# Altium schematic sheet TS Precharge and TSAL.SchDoc
size Tabloid; SheetNumber: 3; SheetTotal: 5
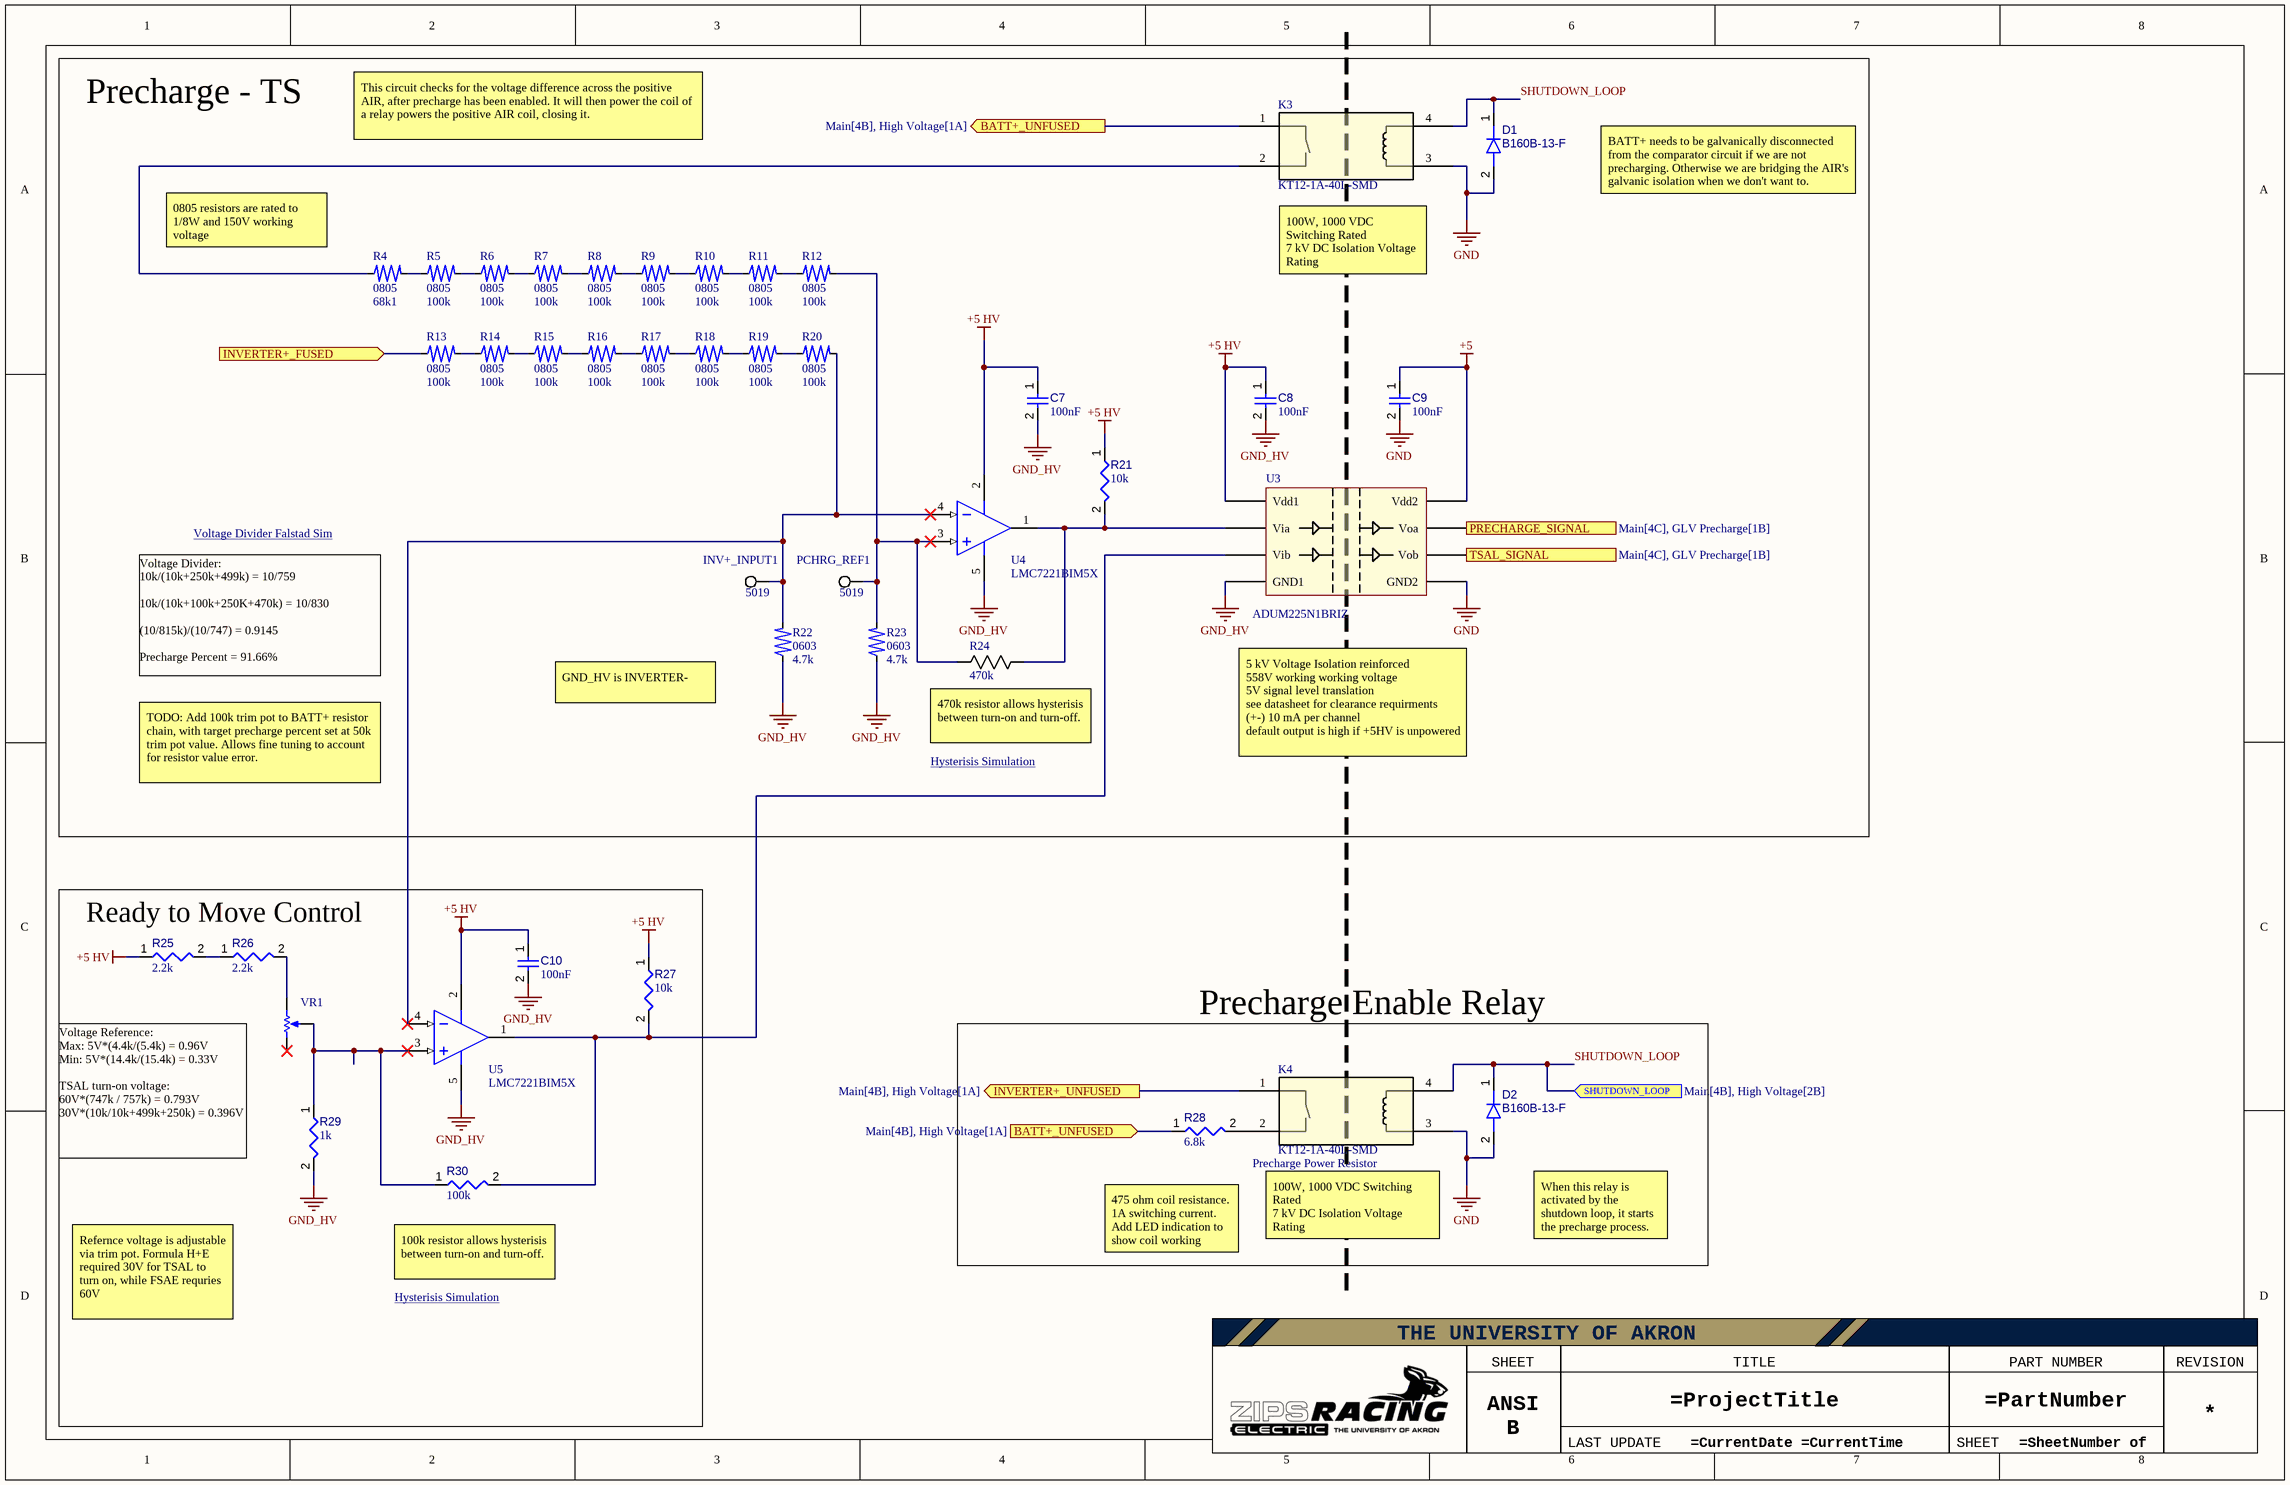
[diagram p0: TS Precharge and TSAL.SchDoc]

## Parts
C7  value 100nF  [CAPC1608X90X40NL10T20]  (hidden comment: Capacitor 100 nF +/-10% 50 V 0603)
C8  value 100nF  [CAPC1608X90X40NL10T20]  (hidden comment: Capacitor 100 nF +/-10% 50 V 0603)
C9  value 100nF  [CAPC1608X90X40NL10T20]  (hidden comment: Capacitor 100 nF +/-10% 50 V 0603)
C10  value 100nF  [CAPC1608X90X40NL10T20]  (hidden comment: Capacitor 100 nF +/-10% 50 V 0603)
D1  B160B-13-F  [FP-SMB-MFG]
D2  B160B-13-F  [FP-SMB-MFG]
INV+_INPUT1  5019  [KSTN-5019_V]
K3  KT12-1A-40L-SMD  [New footprint 1]
K4  KT12-1A-40L-SMD  [New footprint 1]
PCHRG_REF1  5019  [KSTN-5019_V]
R4  value 68k1  Footprint: 0805  [RES-0805-GENERIC]  (hidden comment: Resistor 68k1 0805 1%)
R5  value 100k  Footprint: 0805  [RES-0805-GENERIC]  (hidden comment: Resistor 100k 0805 1%)
R6  value 100k  Footprint: 0805  [RES-0805-GENERIC]  (hidden comment: Resistor 100k 0805 1%)
R7  value 100k  Footprint: 0805  [RES-0805-GENERIC]  (hidden comment: Resistor 100k 0805 1%)
R8  value 100k  Footprint: 0805  [RES-0805-GENERIC]  (hidden comment: Resistor 100k 0805 1%)
R9  value 100k  Footprint: 0805  [RES-0805-GENERIC]  (hidden comment: Resistor 100k 0805 1%)
R10  value 100k  Footprint: 0805  [RES-0805-GENERIC]  (hidden comment: Resistor 100k 0805 1%)
R11  value 100k  Footprint: 0805  [RES-0805-GENERIC]  (hidden comment: Resistor 100k 0805 1%)
R12  value 100k  Footprint: 0805  [RES-0805-GENERIC]  (hidden comment: Resistor 100k 0805 1%)
R13  value 100k  Footprint: 0805  [RES-0805-GENERIC]  (hidden comment: Resistor 100k 0805 1%)
R14  value 100k  Footprint: 0805  [RES-0805-GENERIC]  (hidden comment: Resistor 100k 0805 1%)
R15  value 100k  Footprint: 0805  [RES-0805-GENERIC]  (hidden comment: Resistor 100k 0805 1%)
R16  value 100k  Footprint: 0805  [RES-0805-GENERIC]  (hidden comment: Resistor 100k 0805 1%)
R17  value 100k  Footprint: 0805  [RES-0805-GENERIC]  (hidden comment: Resistor 100k 0805 1%)
R18  value 100k  Footprint: 0805  [RES-0805-GENERIC]  (hidden comment: Resistor 100k 0805 1%)
R19  value 100k  Footprint: 0805  [RES-0805-GENERIC]  (hidden comment: Resistor 100k 0805 1%)
R20  value 100k  Footprint: 0805  [RES-0805-GENERIC]  (hidden comment: Resistor 100k 0805 1%)
R21  value 10k  [RESC1608X55X25ML10T15]  (hidden comment: Resistor 10k +/-1% 0603 100 mW)
R22  value 4.7k  Footprint: 0603  [RES-0603-Generic]  (hidden comment: Resistor 4k7 0603 1%)
R23  value 4.7k  Footprint: 0603  [RES-0603-Generic]  (hidden comment: Resistor 4k7 0603 1%)
R24  value 470k  [R0603]  (hidden comment: RES_0603_470k)
R25  value 2.2k  [RESC1608X55X25LL10T15]  (hidden comment: Resistor 2.2k +/-1% 0603 100mW)
R26  value 2.2k  [RESC1608X55X25LL10T15]  (hidden comment: Resistor 2.2k +/-1% 0603 100mW)
R27  value 10k  [RESC1608X55X25ML10T15]  (hidden comment: Resistor 10k +/-1% 0603 100 mW)
R28  value 6.8k  [New footprint 1]  (hidden comment: HSA506K8J)
R29  value 1k  [RESC1608X55X25ML10T15]  (hidden comment: Resistor 1k +/-1% 0603 100 mW)
R30  value 100k  [RESC1608X55X25ML10T15]  (hidden comment: Resistor 100k +/-1% 0603 100 mW)
U3  ADUM225N1BRIZ  [SOIC127P1030X265-8N]
U4  LMC7221BIM5X  [DBV0005A_L]
U5  LMC7221BIM5X  [DBV0005A_L]
VR1  3362P-1-103LF  [BOUR-3362P]  (value not drawn)

## Blocks framed on the sheet
Precharge - TS: C7-C9 D1 INV+_INPUT1 K3 PCHRG_REF1 R4-R24 U3 U4
Ready to Move Control: C10 R25-R27 R29 R30 U5 VR1
Precharge Enable Relay: D2 K4 R28

## Ports
BATT+_UNFUSED (in, see Main[4B], High Voltage[1A]), BATT+_UNFUSED (out, see Main[4B], High Voltage[1A]), INVERTER+_FUSED (in, see Main[4B], High Voltage[1A], Indicator Light[2A]), INVERTER+_UNFUSED (out, see Main[4B], High Voltage[1A]), PRECHARGE_SIGNAL (out, see Main[4C], GLV Precharge[1B]), SHUTDOWN_LOOP (in, see Main[4B], High Voltage[2B]), TSAL_SIGNAL (out, see Main[4C], GLV Precharge[1B])

## Nets
+5: C9.1 U3.8(Vdd2)
+5 HV: C7.1 C8.1 C10.1 R21.1 R25.1 R27.1 U3.1(Vdd1) U4.2(V+) U5.2(V+)
GND: C9.2 D1.2(A) D2.2(A) K3.3 K4.3 U3.5(GND2)
GND_HV: C7.2 C8.2 C10.2 R22.1 R23.1 R29.2 U3.4(GND1) U4.5(V-) U5.5(V-)
BATT+_UNFUSED: K3.1 R28.1 ; port BATT+_UNFUSED
INVERTER+_FUSED: R13.1 ; port INVERTER+_FUSED
INVERTER+_UNFUSED: K4.1 ; port INVERTER+_UNFUSED
PRECHARGE_SIGNAL: U3.7(Voa) ; port PRECHARGE_SIGNAL
SHUTDOWN_LOOP: D1.1(K) D2.1(K) K3.4 K4.4 ; port SHUTDOWN_LOOP
TSAL_SIGNAL: U3.6(Vob) ; port TSAL_SIGNAL
NetINV+_INPUT1_1: INV+_INPUT1.1 R20.2 R22.2 U4.4(IN-) U5.4(IN-)
NetK3_2: K3.2 R4.1
NetK4_2: K4.2 R28.2
NetPCHRG_REF1_1: PCHRG_REF1.1 R12.2 R23.2 R24.1 U4.3(IN+)
NetR4_2: R4.2 R5.1
NetR5_2: R5.2 R6.1
NetR6_2: R6.2 R7.1
NetR7_2: R7.2 R8.1
NetR8_2: R8.2 R9.1
NetR9_2: R9.2 R10.1
NetR10_2: R10.2 R11.1
NetR11_2: R11.2 R12.1
NetR13_2: R13.2 R14.1
NetR14_2: R14.2 R15.1
NetR15_2: R15.2 R16.1
NetR16_2: R16.2 R17.1
NetR17_2: R17.2 R18.1
NetR18_2: R18.2 R19.1
NetR19_2: R19.2 R20.1
NetR21_2: R21.2 R24.2 U3.2(Via) U4.1(OUT)
NetR25_2: R25.2 R26.1
NetR26_2: R26.2 VR1.3(CW)
NetR27_2: R27.2 R30.2 U3.3(Vib) U5.1(OUT)
NetR29_1: R29.1 R30.1 U5.3(IN+) VR1.2(S)

Not connected (* = marked no-connect by the designer): VR1 1(CCW)*

## Notes on the sheet
- This circuit checks for the voltage difference across the positive AIR, after precharge has been enabled. It will then power the coil of a relay powers the positive AIR coil, closing it.
- BATT+ needs to be galvanically disconnected from the comparator circuit if we are not precharging. Otherwise we are bridging the AIR's galvanic isolation when we don't want to.
- 0805 resistors are rated to 1/8W and 150V working voltage
- (near K3) 100W, 1000 VDC Switching Rated
  7 kV DC Isolation Voltage Rating
- Voltage Divider Falstad Sim <https://tinyurl.com/ywocnskm>
- Voltage Divider:
  10k/(10k+250k+499k) = 10/759
  10k/(10k+100k+250K+470k) = 10/830
  (10/815k)/(10/747) = 0.9145
  Precharge Percent = 91.66%
- GND_HV is INVERTER-
- Hysterisis Simulation <https://tinyurl.com/272h4edf>
- (near R24) 470k resistor allows hysterisis between turn-on and turn-off.
- 5 kV Voltage Isolation reinforced
  558V working working voltage
  5V signal level translation
  see datasheet for clearance requirments
  (+-) 10 mA per channel
  default output is high if +5HV is unpowered
- TODO: Add 100k trim pot to BATT+ resistor chain, with target precharge percent set at 50k trim pot value. Allows fine tuning to account for resistor value error.
- (near VR1) Voltage Reference:
  Max: 5V*(4.4k/(5.4k) = 0.96V
  Min: 5V*(14.4k/(15.4k) = 0.33V
  TSAL turn-on voltage:
  60V*(747k / 757k) = 0.793V
  30V*(10k/10k+499k+250k) = 0.396V
- Precharge Power Resistor
- 100W, 1000 VDC Switching Rated
  7 kV DC Isolation Voltage Rating
- When this relay is activated by the shutdown loop, it starts the precharge process.
- Hysterisis Simulation <https://tinyurl.com/22o4delq>
- (near R30) 100k resistor allows hysterisis between turn-on and turn-off.
- 475 ohm coil resistance. 1A switching current. Add LED indication to show coil working
- Refernce voltage is adjustable via trim pot. Formula H+E required 30V for TSAL to turn on, while FSAE requries 60V
- THE UNIVERSITY OF AKRON
- SHEET SIZE
- TITLE
- PART NUMBER
- REVISION
- ANSI B
- LAST UPDATE
- SHEET

## Library data of the parts
C7-C10 = CMP-001-00017-6: Chip Capacitor, 100 nF, +/- 10%, 50 V, 0603 (1608 Metric); Voltage Rating: 50V; Capacitor Type: Ceramic; Tolerance: 10%; Mounting Technology: SM; Max Operating Temperature: 125°C; RoHS Compliant: True; Pins: 2; Case/Package: 0603; Min Operating Temperature: -55°C
D1 D2 = CMP-004-00032-1: Rectifier Diode, Schottky, 1 Phase, 1 Element, 1A, 60V V(RRM), Silicon; Forward Voltage: 700mV; Qualification Status: Not Qualified; RoHS Compliant: Yes; Surface Mount: Yes; Max Operating Temperature: 150°C; Max Output current: 1A; Min Operating Temperature: -65°C; Technology: SCHOTTKY; Pins: 2
INV+_INPUT1 PCHRG_REF1 = CMP-00012-1: Interconnection Device
K3 K4 = CMP-008-00007-2: Reed Relay 12VDC 475Ohm 1A SPST-NO(30.2x17x8.7)mm SMD Dry Automotive; Coil Current: 25mA; Coil Resistance: 475R; Coil Power: 303mW; Height: 8.7mm; Max Operating Temperature: 100°C; Case/Package: SMD/SMT; ComponentLink1URL: https://4a30d8fd18dae1bf393d-df49f4cedb726ad03ad145d2e3d346bd.ssl.cf5.rackcdn.com/datasheets/90/9012185401e.pdf; ComponentLink1Description: Datasheet
R4 = CMP-00088-1: Resistor, 0805, 1%, 1/10W; Power: 125mW; Datasheet: https://www.seielect.com/catalog/sei-rmcf_rmcp.pdf; Tolerance: 1%; Max Operating Temperature: 155°C; Min Operating Temperature: -55°C
R5-R20 = CMP-00087-1: Resistor, 0805, 1%, 1/10W; Tolerance: 5%; Power: 125mW; Datasheet: https://www.seielect.com/catalog/sei-rmcf_rmcp.pdf; Min Operating Temperature: -55°C; Max Operating Temperature: 155°C
R21 R27 = CMP-009-00017-5: Chip Resistor, 10 KOhm, +/- 1%, 01 W, -55 to 155 degC, 0603 (1608 Metric); Voltage Rating: 50V; Power: 100mW; RoHS Compliant: True; Min Operating Temperature: -55°C; Pins: 2; Case/Package: 0603; Mounting Technology: SM; Max Operating Temperature: 155°C; Tolerance: 1%
R22 R23 = CMP-00023-4: Resistor, 0603, 1%, 1/10W; Power: 100mW; Tolerance: 1%; Max Operating Temperature: 155°C; Min Operating Temperature: -55°C; Datasheet: https://www.seielect.com/catalog/sei-rmcf_rmcp.pdf
R24 = CMP-009-00246-1: RES SMD 470K OHM 1% 0603; Manufacturer_Part_Number: RC0603JR-070RL; Built_By: EMA_UL_Team; SourceLibrary: Yageo_2018-12-15; Vendor: Yageo; Source: Zips_Racing_Electric.SchLib; Type: DEV; RefDes: RefDes; Copyright: Copyright (C) 2018 Accelerated Designs. All rights reserved; Case/Package: 0603; Design Item ID: RES_0603_470k
R25 R26 = CMP-009-00198-1: Description Chip Resistor, 2.2 KOhm, +/-1%, 0.1 W, -55 to 155 degC, 0603 (1608 Metric); Temperature Coefficient: 100ppm/°C; Rated Temperature: 70°C; Tolerance: 1%; Working Voltage: 75V; Case/Package: 0603; Power: 100mW; Mounting Technology: Surface Mount; Min Operating Temperature: -55°C; Max Operating Temperature: 155°C; RoHS Compliant: Yes; Pins: 2
R28 = CMP-00064-2: Fixed Resistor, Wire Wound, 50W, 6800ohm, 1250V, 5% +/-Tol, 30ppm/Cel, Chassis Mount; RoHS Compliant: Yes; Mounting Technology: Chassis Mount; Pins: 2; Tolerance: 5%; Power: 50W; Max Operating Temperature: 250°C
R29 = CMP-009-00014-5: Chip Resistor, 1 KOhm, +/-1%, 0.1 W, -55 to 155 degC, 0603 (1608 Metric); Voltage Rating: 50V; Power: 100mW; Tolerance: 1%; Mounting Technology: SM; Pins: 2; Case/Package: 0603; Min Operating Temperature: -55°C; RoHS Compliant: True; Max Operating Temperature: 155°C
R30 = CMP-009-00023-5: Chip Resistor, 100 KOhm, +/- 1%, 0.1 W, -55 to 155 degC, 0603 (1608 Metric); Voltage Rating: 50V; Power: 100mW; Max Operating Temperature: 155°C; RoHS Compliant: True; Tolerance: 1%; Pins: 2; Case/Package: 0603; Mounting Technology: SM; Min Operating Temperature: -55°C
U3 = CMP-015-00008-2: Analog Circuit, 1 Func, CMOS, PDSO8; Max Supply Voltage: 5V; Min Supply Voltage: 1.7V; Nominal Supply Voltage: 1.8V; Surface Mount: Yes; Max Operating Temperature: 125°C; Case/Package: SOP; Temperature Grade: AUTOMOTIVE; RoHS Compliant: Yes; Technology: CMOS; Min Operating Temperature: -40°C; Pins: 8
U4 U5 = CMP-016-00012-2: Tiny CMOS Comparator with ail-to- ail Input and Open Drain Output 5-SOT-23 -40 to 85; Output Type: OPEN-DRAIN; Nominal Supply Voltage: 5V; Power Supplies: 2.7/15V; RoHS Compliant: No; Pins: 5; Case/Package: LSSOP; Technology: CMOS; Min Operating Temperature: -40°C; Surface Mount: Yes; Amplifier Type: COMPARATOR; Max Operating Temperature: 85°C
VR1 = CMP-009-00039-2: Square Trimpot(R) Trimming Potentiometer, 10 KOhm, 300 V, -55 to 125 degC, 3-Pin THD, RoHS, Tube; Manufacturer: Bourns; Tolerance: 10%; Power: 500mW; Voltage Rating: 300V; Resistance: 10k; Packaging: Rail/Tube; Package Reference: 3326P; Manufacturer URL: http://www.bourns.com/; Composition: Potentiometer; Package Description: 3-Pin Through Hole Device, Body 6.6 x 6.99 mm, Pitch 2.54 mm; Max Operating Temperature: 125°C; Min Operating Temperature: -55°C; Datasheet Version: May-16; Lead Pitch: 2.54mm; Pins: 3; Datasheet URL: http://www.bourns.com/docs/Product-Datasheets/3362.pdf; Package Quantity: 250; Case/Package: 3326P; RoHS Compliant: True; Mounting Technology: TH